# Altium schematic sheet Mother_board_USB_HUB.SchDoc
size 297 x 420 mm; PageSetup: Record=PageOptions|CenterHorizontal=True|CenterVertical=True|PrintScale=1.00|XCorrection=1.00|YCorrection=1.00|PrintKind=1|BorderSize=5000000|LeftOffset=0|BottomOffset=0|Orientation=2|PaperLength=1000|PaperWidth=1000|Scale=100|PaperSource=15|PrintQuality=1200|MediaType=1|DitherType=10|PaperKind=A3|PrintScaleMode=1; Weight: -; ScaleFactor: -; NormInspection: Норм.Контр.
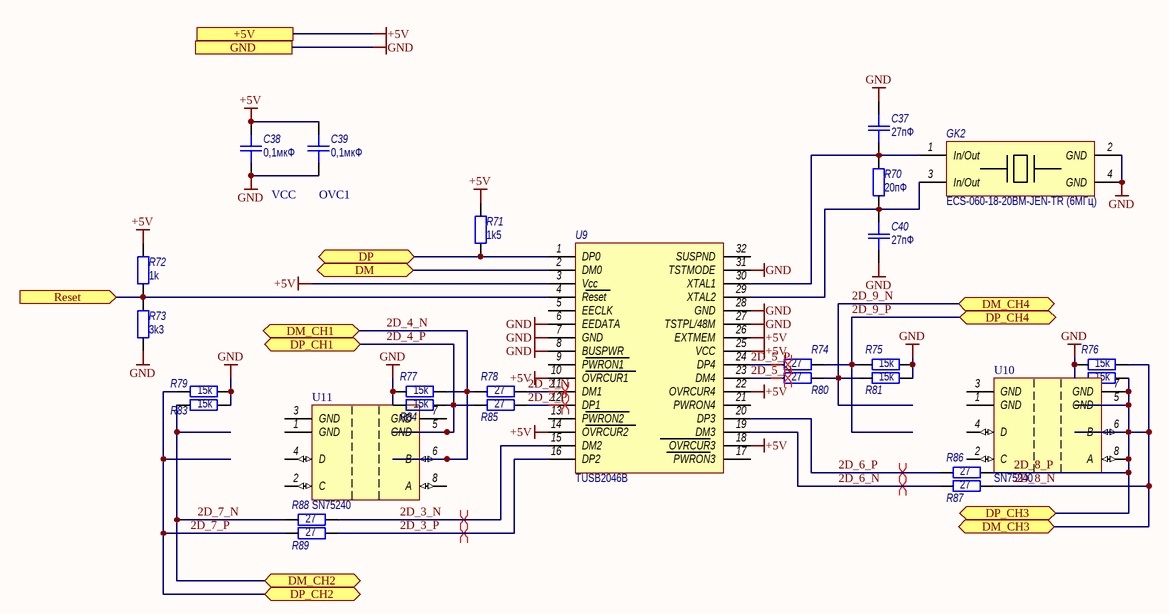
[diagram p0: Mother_board_USB_HUB.SchDoc]

## Parts
C37  27пФ  [SMD_0805]
C38  0,1мкФ  [SMD_0805]
C39  0,1мкФ  [SMD_0805]
C40  27пФ  [SMD_0805]
GK2  Наименование: ECS-060-18-20BM-JEN-TR (6МГц)  [SMD_7050_Crystal_Oscillator]
R70  20пФ  [SMD_0805]
R71  1k5  [SMD_0805]
R72  1k  [SMD_0805]
R73  3k3  [SMD_0805]
R74  27  [SMD_0805]
R75  15k  [SMD_0805]
R76  15k  [SMD_0805]
R77  15k  [SMD_0805]
R78  27  [SMD_0805]
R79  15k  [SMD_0805]
R80  27  [SMD_0805]
R81  15k  [SMD_0805]
R82  15k  [SMD_0805]
R83  15k  [SMD_0805]
R84  15k  [SMD_0805]
R85  27  [SMD_0805]
R86  27  [SMD_0805]
R87  27  [SMD_0805]
R88  27  [SMD_0805]
R89  27  [SMD_0805]
U9  TUSB2046B  [TUSB2046B]
U10  SN75240  [SN75240]
U11  SN75240  [SN75240]

## Ports
+5V, DM (bidir), DM_CH1 (bidir), DM_CH2 (bidir), DM_CH3 (bidir), DM_CH4 (bidir), DP (bidir), DP_CH1 (bidir), DP_CH2 (bidir), DP_CH3 (bidir), DP_CH4 (bidir), GND, Reset (in)

## Nets
+5V: C38.2 C39.2 R71.2 R72.2 U9.3(Vcc) U9.10(OVRCUR1) U9.14(OVRCUR2) U9.18(OVRCUR3) U9.22(OVRCUR4) U9.25(VCC) U9.26(EXTMEM) ; port +5V
GND: C37.2 C38.1 C39.1 C40.2 GK2.2(GND) GK2.4(GND) R73.1 R75.2 R76.1 R77.1 R79.2 R81.2 R82.1 R83.2 R84.1 U9.6(EEDATA) U9.7(GND) U9.8(BUSPWR) U9.27(TSTPL/48M) U9.28(GND) U9.31(TSTMODE) ; port GND
2D_2_N: R78.2 U9.11(DM1)
2D_2_P: R85.2 U9.12(DP1)
2D_3_N: R88.2 U9.15(DM2)
2D_3_P: R89.2 U9.16(DP2)
2D_4_N: R77.2 R78.1 U11.6(B) ; port DM_CH1
2D_4_P: R84.2 R85.1 U11.5(GND) ; port DP_CH1
2D_5_N: R80.1 U9.23(DM4)
2D_5_P: R74.1 U9.24(DP4)
2D_6_N: R87.1 U9.19(DM3)
2D_6_P: R86.1 U9.20(DP3)
2D_7_N: R83.1 R88.1 ; port DM_CH2
2D_7_P: R79.1 R89.1 ; port DP_CH2
2D_8_N: R76.2 R82.2 R86.2 R87.2 U10.5(GND) U10.6(B) U10.7(GND) U10.8(A) ; port DP_CH3, port DM_CH3  [also labelled 2D_8_P]
2D_9_N: R80.2 R81.1 ; port DM_CH4
2D_9_P: R74.2 R75.1 ; port DP_CH4
DM: U9.2(DM0) ; port DM
DP: R71.1 U9.1(DP0) ; port DP
Reset: R72.1 R73.2 U9.4(Reset) ; port Reset
NetC37_1: C37.1 GK2.1(In/Out) R70.1 U9.30(XTAL1)
NetC40_1: C40.1 GK2.3(In/Out) R70.2 U9.29(XTAL2)

Not connected (* = marked no-connect by the designer): U9 5(EECLK) 9(PWRON1) 13(PWRON2) 17(PWRON3) 21(PWRON4) 32(SUSPND); U10 1(GND) 2(C) 3(GND) 4(D); U11 1(GND) 2(C) 3(GND) 4(D) 7(GND) 8(A)

## Layout directives
differential pair: 2D_2_N, 2D_2_P, 2D_3_N, 2D_3_P, 2D_5_N, 2D_5_P, 2D_6_N, 2D_6_P

## Notes on the sheet
- VCC
- (near C39) OVC1
- Перв. примен.
- Справ. №
- Подп. и дата
- Инв. № дубл.
- Взам. инв. №
- Разраб.
- Изм.
- Лист
- № докум.
- Подп.
- Дата
- Литера
- Масса
- Масштаб
- Пров.
- Т.контр.
- Листов
- Инв. № подл.
- Н.контр.
- Утв.
- Форма 1 ГОСТ 2.104-2006
- Копировал
- Формат А3

## Library data of the parts
C37-C40 = Capacitor: Назначение: SMD-конденсатор; Наименование: Конденсатор; Потребление, Вт: 0
  C37 C40: Value: 27пФ
  C38 C39: Value: 0,1мкФ
GK2 = Crystal: Crystall; Назначение: Кварцевый генератор; Потребление, Вт: 0,165; ComponentLink1Description: DataSheet; ComponentLink1URL: http://www.lit-phonon.ru/downloads/GK108-P.pdf
R70-R89 = Resistor: Наименование: Резистор; Назначение: SMD-резистор; Потребление, Вт: 0,001
  R70: Value: 20пФ
  R71: Value: 1k5
  R72: Value: 1k
  R73: Value: 3k3
  R74 R78 R80 R85-R89: Value: 27
  R75-R77 R79 R81-R84: Value: 15k
U9 = TUSB2046B: TUSB2046x 4-Port USB-концентратор; Потребление, Вт: 0,165; Назначение: USB-концентратор; ComponentLink1Description: DataSheet; ComponentLink1URL: http://www.lit-phonon.ru/downloads/GK108-P.pdf; Наименование: TUSB2046B
U10 U11 = SN75240: ESD-защита; Потребление, Вт: 0; Назначение: ESD-защита; Наименование: SN75240